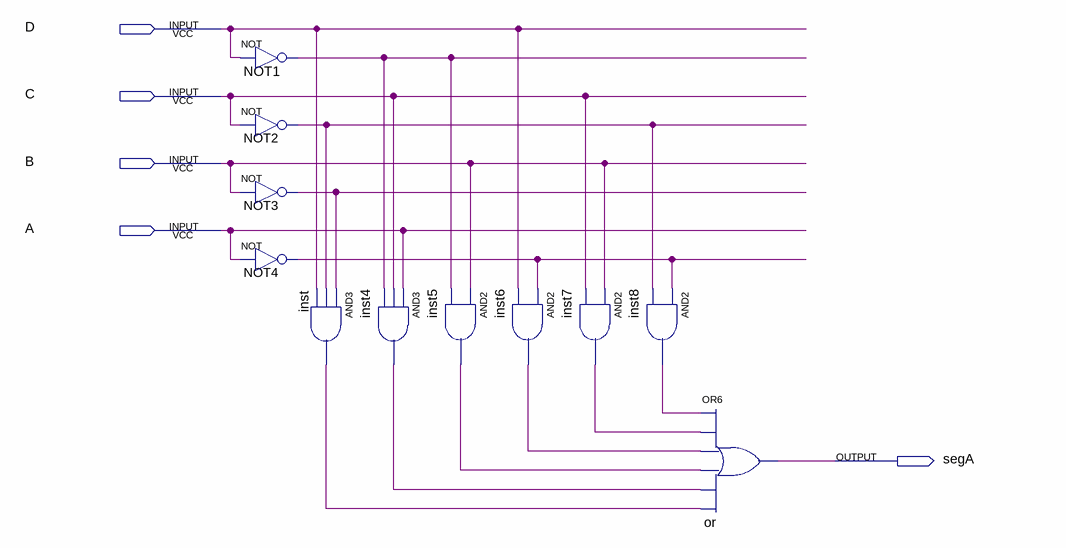
[diagram p0: schematic sheet]
// Quartus schematic segA.bdf as structural Verilog: 11 symbols, 5 pins
module segA (
  input  D,
  input  C,
  input  B,
  input  A,
  output segA
);

  wire inst4_out, inst5_out, inst6_out, inst7_out, inst8_out, inst_out, NOT1_out, NOT2_out, NOT3_out,
       NOT4_out;

  not NOT1 (NOT1_out, D);
  not NOT2 (NOT2_out, C);
  not NOT3 (NOT3_out, B);
  not NOT4 (NOT4_out, A);
  and inst (inst_out, NOT3_out, NOT2_out, D);
  and inst4 (inst4_out, A, C, NOT1_out);
  and inst5 (inst5_out, B, NOT1_out);
  and inst6 (inst6_out, NOT4_out, D);
  and inst7 (inst7_out, B, C);
  and inst8 (inst8_out, NOT4_out, NOT2_out);
  or \or  (segA, inst8_out, inst7_out, inst6_out, inst5_out, inst4_out, inst_out);
endmodule
